# Altium schematic sheet Shcematic.SchDoc
size A4; SheetNumber: 1; SheetTotal: 1
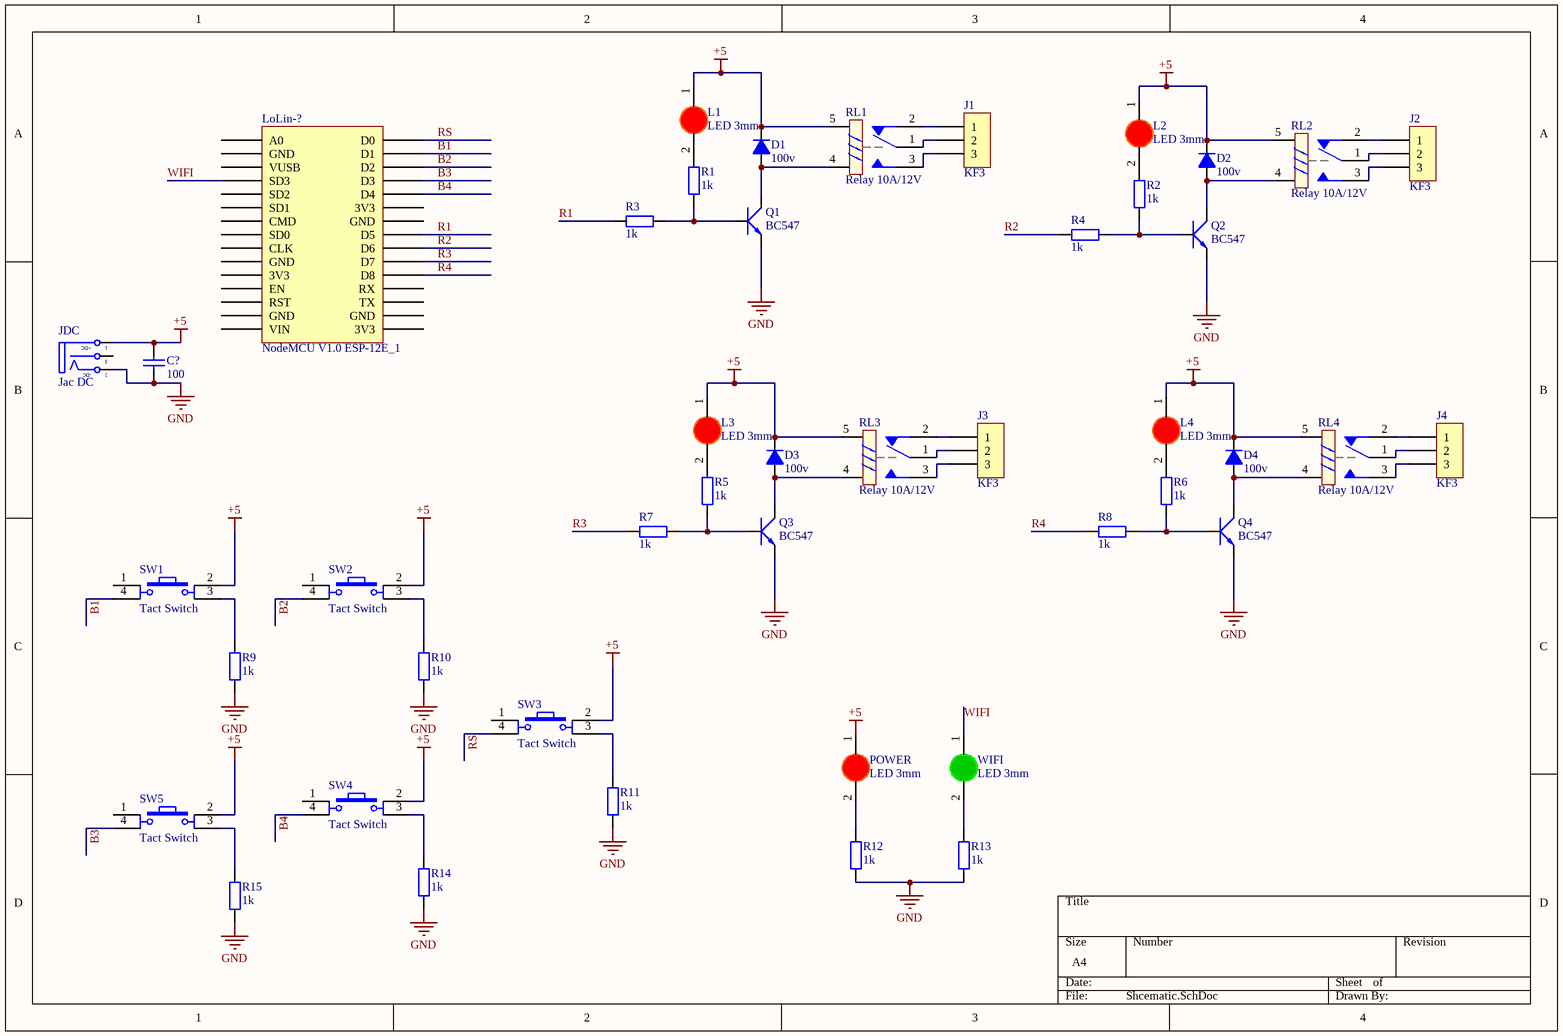
[diagram p0: Shcematic.SchDoc]

## Parts
C?  100  [tu gom]
D1  100v  [DIODE 1A]
D2  100v  [DIODE 1A]
D3  100v  [DIODE 1A]
D4  100v  [DIODE 1A]
J1  KF3  [KF3-5.08]
J2  KF3  [KF3-5.08]
J3  KF3  [KF3-5.08]
J4  KF3  [KF3-5.08]
JDC  Jac DC  [DC0]
L1  LED 3mm  [LED-3MM-RED]
L2  LED 3mm  [LED-3MM-RED]
L3  LED 3mm  [LED-3MM-RED]
L4  LED 3mm  [LED-3MM-RED]
LoLin-?  NodeMCU V1.0 ESP-12E_1  [LoLin NodeMcu V3]
POWER  LED 3mm  [LED-3MM-RED]
Q1  BC547  [TO92-123]
Q2  BC547  [TO92-123]
Q3  BC547  [TO92-123]
Q4  BC547  [TO92-123]
R1  1k  [RES-1/4W]
R2  1k  [RES-1/4W]
R3  1k  [RES-1/4W]
R4  1k  [RES-1/4W]
R5  1k  [RES-1/4W]
R6  1k  [RES-1/4W]
R7  1k  [RES-1/4W]
R8  1k  [RES-1/4W]
R9  1k  [RES-1/4W]
R10  1k  [RES-1/4W]
R11  1k  [RES-1/4W]
R12  1k  [RES-1/4W]
R13  1k  [RES-1/4W]
R14  1k  [RES-1/4W]
R15  1k  [RES-1/4W]
RL1  Relay 10A/12V  [RL_SPDT_10A]
RL2  Relay 10A/12V  [RL_SPDT_10A]
RL3  Relay 10A/12V  [RL_SPDT_10A]
RL4  Relay 10A/12V  [RL_SPDT_10A]
SW1  Tact Switch  [SW4_12x12]
SW2  Tact Switch  [SW4_12x12]
SW3  Tact Switch  [SW4_12x12]
SW4  Tact Switch  [SW4_12x12]
SW5  Tact Switch  [SW4_12x12]
WIFI  LED 3mm  [LED-3MM-GREEN]

## Nets
+5: C?.1 D1.2(K) D2.2(K) D3.2(K) D4.2(K) JDC.1(T) L1.1(A) L2.1(A) L3.1(A) L4.1(A) POWER.1(A) RL1.5 RL2.5 RL3.5 RL4.5 SW1.2 SW2.2 SW3.2 SW4.2 SW5.2
GND: C?.2 JDC.2(TN) Q1.1(E) Q2.1(E) Q3.1(E) Q4.1(E) R9.2 R10.2 R11.2 R12.1 R13.1 R14.2 R15.2
B1: LoLin-?.D1 SW1.4
B2: LoLin-?.D2 SW2.4
B3: LoLin-?.D3 SW5.4
B4: LoLin-?.D4 SW4.4
R1: LoLin-?.D5 R3.1
R2: LoLin-?.D6 R4.1
R3: LoLin-?.D7 R7.1
R4: LoLin-?.D8 R8.1
RS: LoLin-?.D0 SW3.4
WIFI: LoLin-?.SD3 WIFI.1(A)
NetD1_1: D1.1(A) Q1.2(C) RL1.4
NetD2_1: D2.1(A) Q2.2(C) RL2.4
NetD3_1: D3.1(A) Q3.2(C) RL3.4
NetD4_1: D4.1(A) Q4.2(C) RL4.4
NetJ1_1: J1.1 RL1.2
NetJ1_2: J1.2 RL1.1
NetJ1_3: J1.3 RL1.3
NetJ2_1: J2.1 RL2.2
NetJ2_2: J2.2 RL2.1
NetJ2_3: J2.3 RL2.3
NetJ3_1: J3.1 RL3.2
NetJ3_2: J3.2 RL3.1
NetJ3_3: J3.3 RL3.3
NetJ4_1: J4.1 RL4.2
NetJ4_2: J4.2 RL4.1
NetJ4_3: J4.3 RL4.3
NetL1_2: L1.2(K) R1.2
NetL2_2: L2.2(K) R2.2
NetL3_2: L3.2(K) R5.2
NetL4_2: L4.2(K) R6.2
NetPOWER_2: POWER.2(K) R12.2
NetQ1_3: Q1.3(B) R1.1 R3.2
NetQ2_3: Q2.3(B) R2.1 R4.2
NetQ3_3: Q3.3(B) R5.1 R7.2
NetQ4_3: Q4.3(B) R6.1 R8.2
NetR9_1: R9.1 SW1.3
NetR10_1: R10.1 SW2.3
NetR11_1: R11.1 SW3.3
NetR13_2: R13.2 WIFI.2(K)
NetR14_1: R14.1 SW4.3
NetR15_1: R15.1 SW5.3

Not connected (* = marked no-connect by the designer): JDC 3(S); LoLin-? 3V3 A0 CLK CMD EN GND RST RX SD0 SD1 SD2 TX VIN VUSB; SW1 1; SW2 1; SW3 1; SW4 1; SW5 1

## Notes on the sheet
- (in symbol DCIN) +DC; -DC

## Library data of the parts
C? = Tu gom 100 50V: Cắm; Don_Vi: Con; So_Chan: 2; Ten_Linh_Kien: Tụ gốm 100 10pF 50V; Ma_Hang: MH004765; Chung_Loai: Cắm; Kieu_Chan: *
D1-D4 = Diode 1N4007: Cắm; Ten_Linh_Kien: Diode 1N4007 1A (DIP); Don_Vi: Con; Ma_Hang: MH001063; Ghi Chu: *; Kieu_Chan: *; Chung_Loai: Cắm
J1-J4 = KF3: Manufacturer: Würth Elektronik eiSos GmbH; partNo: 691103110003; ComponentLink1 Description: Manufacturer; ComponentLink2 Description: Datasheet; NoPins: 3; Created Date: 29 October 2013; ComponentLink1URL: http://www.we-online.com; ComponentLink2URL: http://katalog.we-online.de/em/datasheet/6911031100xx.pdf; Created by: Karrer Zheng
JDC = DCIN: Jac DC input; Value: Jac DC
L1-L4 POWER = LED 3mm Do: Cắm; Don_Vi: Con; Ma_Hang: MH003892; Ten_Linh_Kien: Led 3MM Phủ Đỏ (10c); Ghi_Chu: *; Kieu_Chan: *; Chung_Loai: Cắm
LoLin-? = NodeMCU V1.0 ESP-12E_1: LoLin NodeMCU V3
Q1-Q4 = 2SC1815: NPN 600mW, ECB; Value: C1815
R1-R15 = R: Resistor R1/4W
RL1-RL4 = Relay 1: Relay SPDT,10A - 12VDC 5 Pin; Value: Relay SPDT, 10A, 12V
SW1-SW5 = SW4: Value: Button chip 4 pin
WIFI = LED 3mm Xanh La: Cắm; Don_Vi: Con; Ma_Hang: MH001054; Ten_Linh_Kien: Led 3MM Phủ Xanh (10c); Ghi_Chu: *; Kieu_Chan: *; Chung_Loai: Cắm